# EAGLE design sensor (EAGLE 7.7.0)
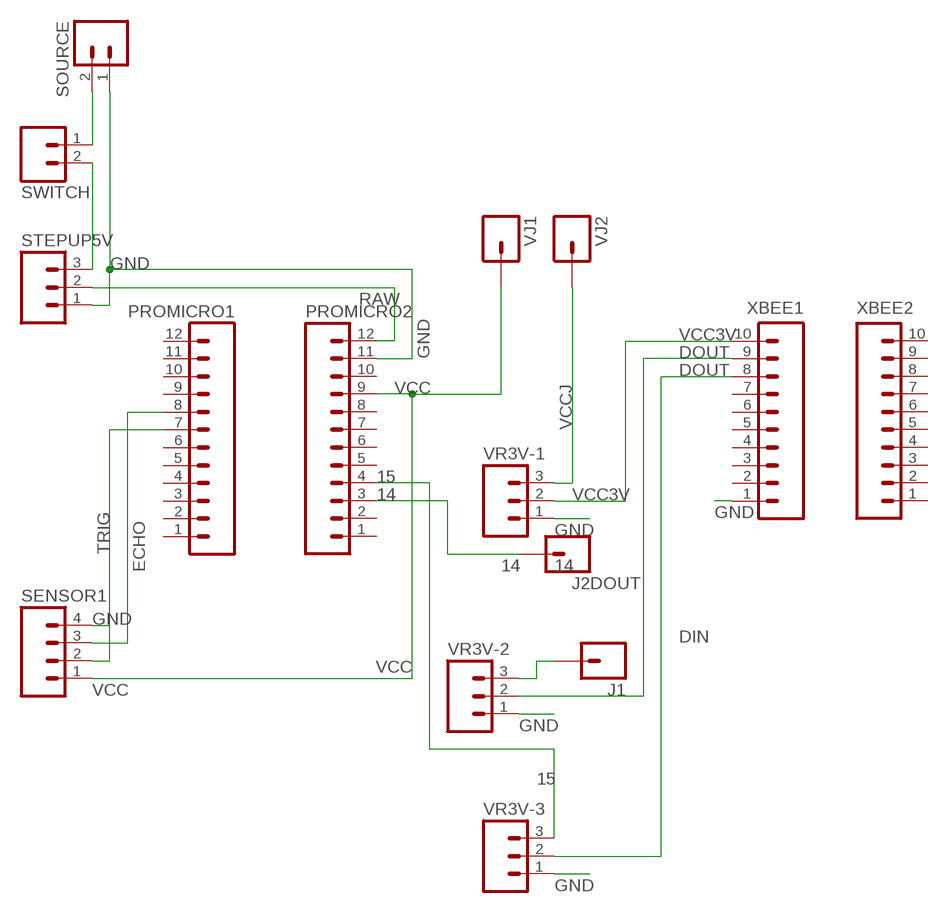
[diagram p0: schematic, sheet 1]

## Parts
J1  M01PTH  [1X01]
J2  M01PTH  [1X01]
PROMICRO1  M12LOCK  [1X12_LOCK]
PROMICRO2  M12LOCK  [1X12_LOCK]
SENSOR1  M04LOCK  [1X04_LOCK]
SOURCE  M02JST-PTH-VERT  [JST-2-PTH-VERT]
STEPUP5V  M03PTH  [1X03]
SWITCH  M02PTH  [1X02]
VJ1  M01PTH  [1X01]
VJ2  M01PTH  [1X01]
VR3V-1  M03PTH  [1X03]
VR3V-2  M03PTH  [1X03]
VR3V-3  M03PTH  [1X03]
XBEE1  M10LOCK  [1X10_LOCK]
XBEE2  M10LOCK  [1X10_LOCK]

## Nets
14: J2.1 PROMICRO2.3
15: PROMICRO2.4 VR3V-3.3
DIN: VR3V-3.2 XBEE1.8
DOUT: VR3V-2.2 XBEE1.9
ECHO: PROMICRO1.8 SENSOR1.3
GND: PROMICRO2.11 SENSOR1.4 SOURCE.1 STEPUP5V.1 VR3V-1.1 VR3V-2.1 VR3V-3.1 XBEE1.1
N$1: SOURCE.2 SWITCH.1
N$2: STEPUP5V.3 SWITCH.2
N$3: J1.1 VR3V-2.3
RAW: PROMICRO2.12 STEPUP5V.2
TRIG: PROMICRO1.7 SENSOR1.2
VCC: PROMICRO2.9 SENSOR1.1 VJ1.1
VCC3V: VR3V-1.2 XBEE1.10
VCCJ: VJ2.1 VR3V-1.3
Unconnected: PROMICRO1.1 PROMICRO1.2 PROMICRO1.3 PROMICRO1.4 PROMICRO1.5 PROMICRO1.6 PROMICRO1.9 PROMICRO1.10 PROMICRO1.11 PROMICRO1.12 PROMICRO2.1 PROMICRO2.2 PROMICRO2.5 PROMICRO2.6 PROMICRO2.7 PROMICRO2.8 PROMICRO2.10 XBEE1.2 XBEE1.3 XBEE1.4 XBEE1.5 XBEE1.6 XBEE1.7 XBEE2.1 XBEE2.2 XBEE2.3 XBEE2.4 XBEE2.5 XBEE2.6 XBEE2.7 XBEE2.8 XBEE2.9 XBEE2.10

## Library data of the parts
J1 J2 VJ1 VJ2 = SparkFun-Connectors:M01: Header 1 Standard 1-pin 0.1" header. Use with straight break away headers (SKU : PRT-00116), right angle break away headers (PRT-00553), swiss pins (PRT-00743), machine pins (PRT-00117), and female headers (PRT-00115). SMTSO-256-ET is a "flush mount" nut for a 4-40 screw. The older package used to be too tight, and did not allow it to sit properly thru the drill hit. The latest (0.165DIA) fits nice and snug.
PROMICRO1 PROMICRO2 = SparkFun-Connectors:M12: Header 12 Standard 12-pin 0.1" header. Use with straight break away headers (SKU : PRT-00116), right angle break away headers (PRT-00553), swiss pins (PRT-00743), machine pins (PRT-00117), and female headers (PRT-00115).
SENSOR1 = SparkFun-Connectors:M04: Header 4 Standard 4-pin 0.1" header. Use with straight break away headers (SKU : PRT-00116), right angle break away headers (PRT-00553), swiss pins (PRT-00743), machine pins (PRT-00117), and female headers (PRT-00115). Molex polarized connector foot print use with SKU : PRT-08231 with associated crimp pins and housings. 1MM SMD Version SKU: PRT-10208; PROD_ID: CONN-09696
SOURCE SWITCH = SparkFun-Connectors:M02: Standard 2-pin 0.1" header. Use with - straight break away headers ( PRT-00116) - right angle break away headers (PRT-00553) - swiss pins (PRT-00743) - machine pins (PRT-00117) - female headers (PRT-00115) Molex polarized connector foot print use with: PRT-08233 with associated crimp pins and housings. 2.54_SCREWTERM for use with PRT-10571. 3.5mm Screw Terminal footprints for PRT-08084 5mm Screw Terminal footprints for use with PRT-08432
STEPUP5V VR3V-1-VR3V-3 = SparkFun-Connectors:M03: Header 3 Standard 3-pin 0.1" header. Use with straight break away headers (SKU : PRT-00116), right angle break away headers (PRT-00553), swiss pins (PRT-00743), machine pins (PRT-00117), and female headers (PRT-00115). Molex polarized connector foot print use with SKU : PRT-08232 with associated crimp pins and housings.
XBEE1 XBEE2 = SparkFun-Connectors:M10: Header 10 Standard 10-pin 0.1" header. Use with straight break away headers (SKU : PRT-00116), right angle break away headers (PRT-00553), swiss pins (PRT-00743), machine pins (PRT-00117), and female headers (PRT-00115).

## Board
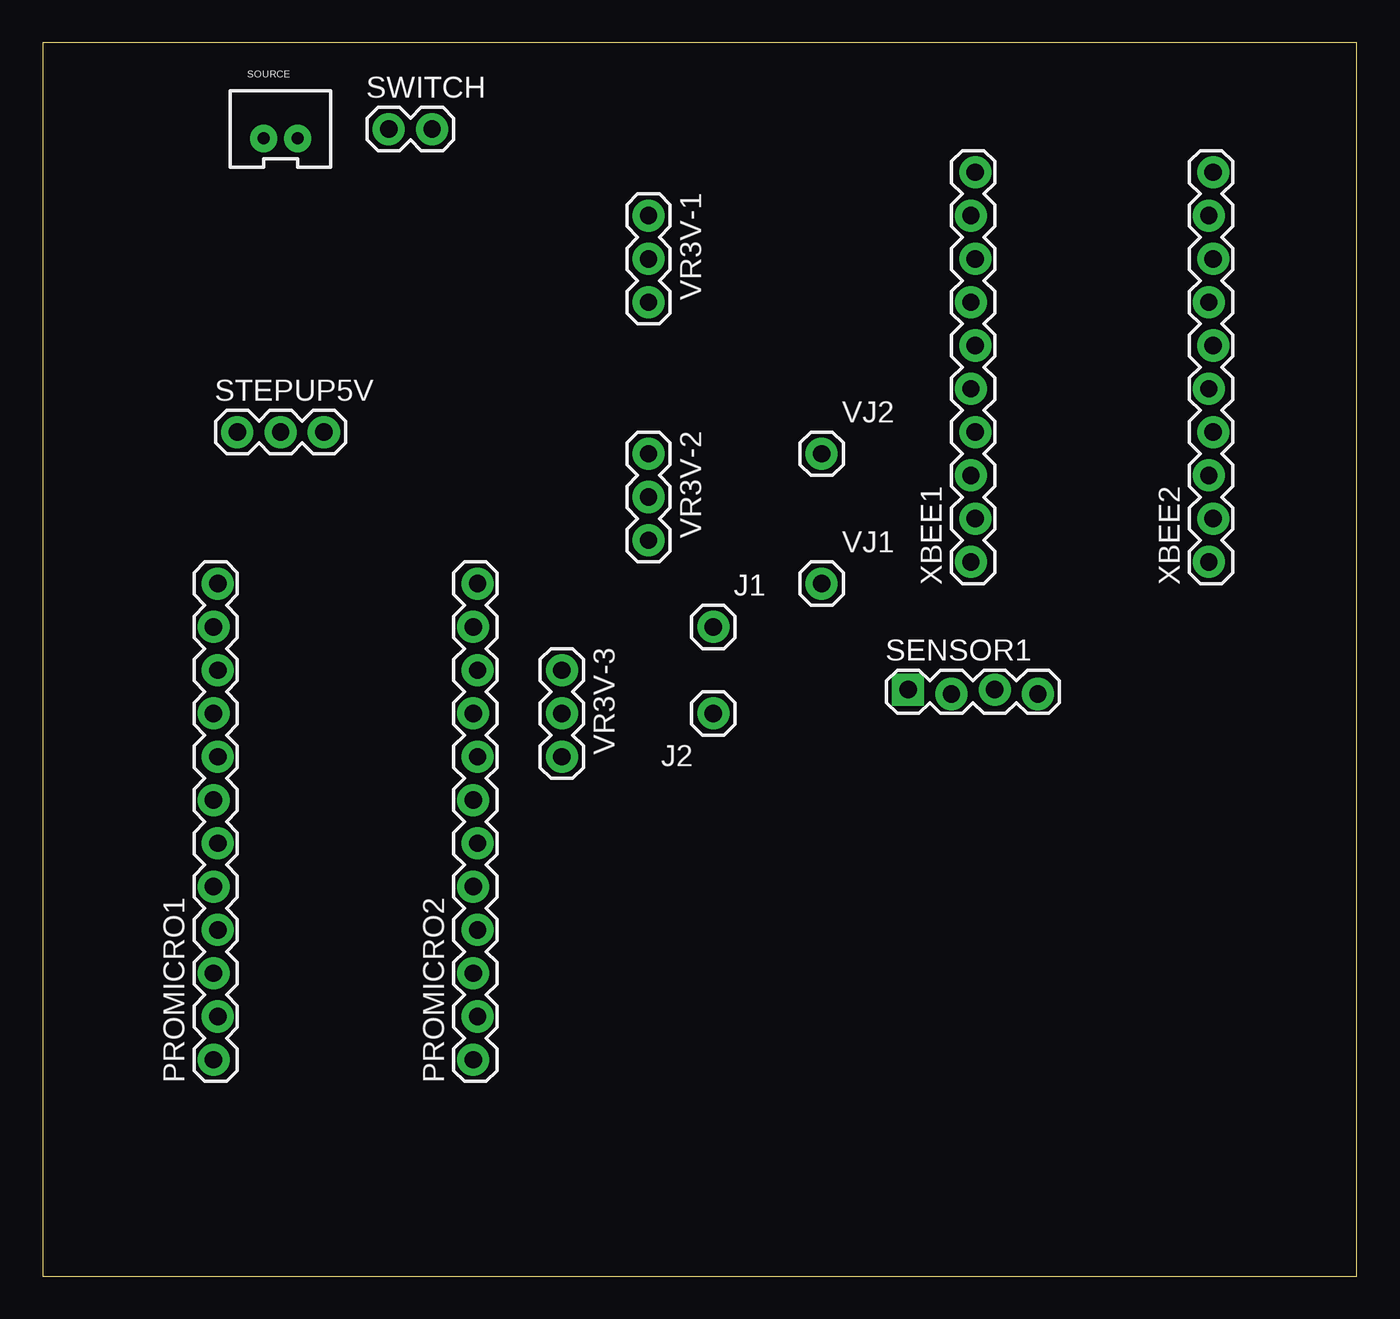
[diagram p1: board, top side]
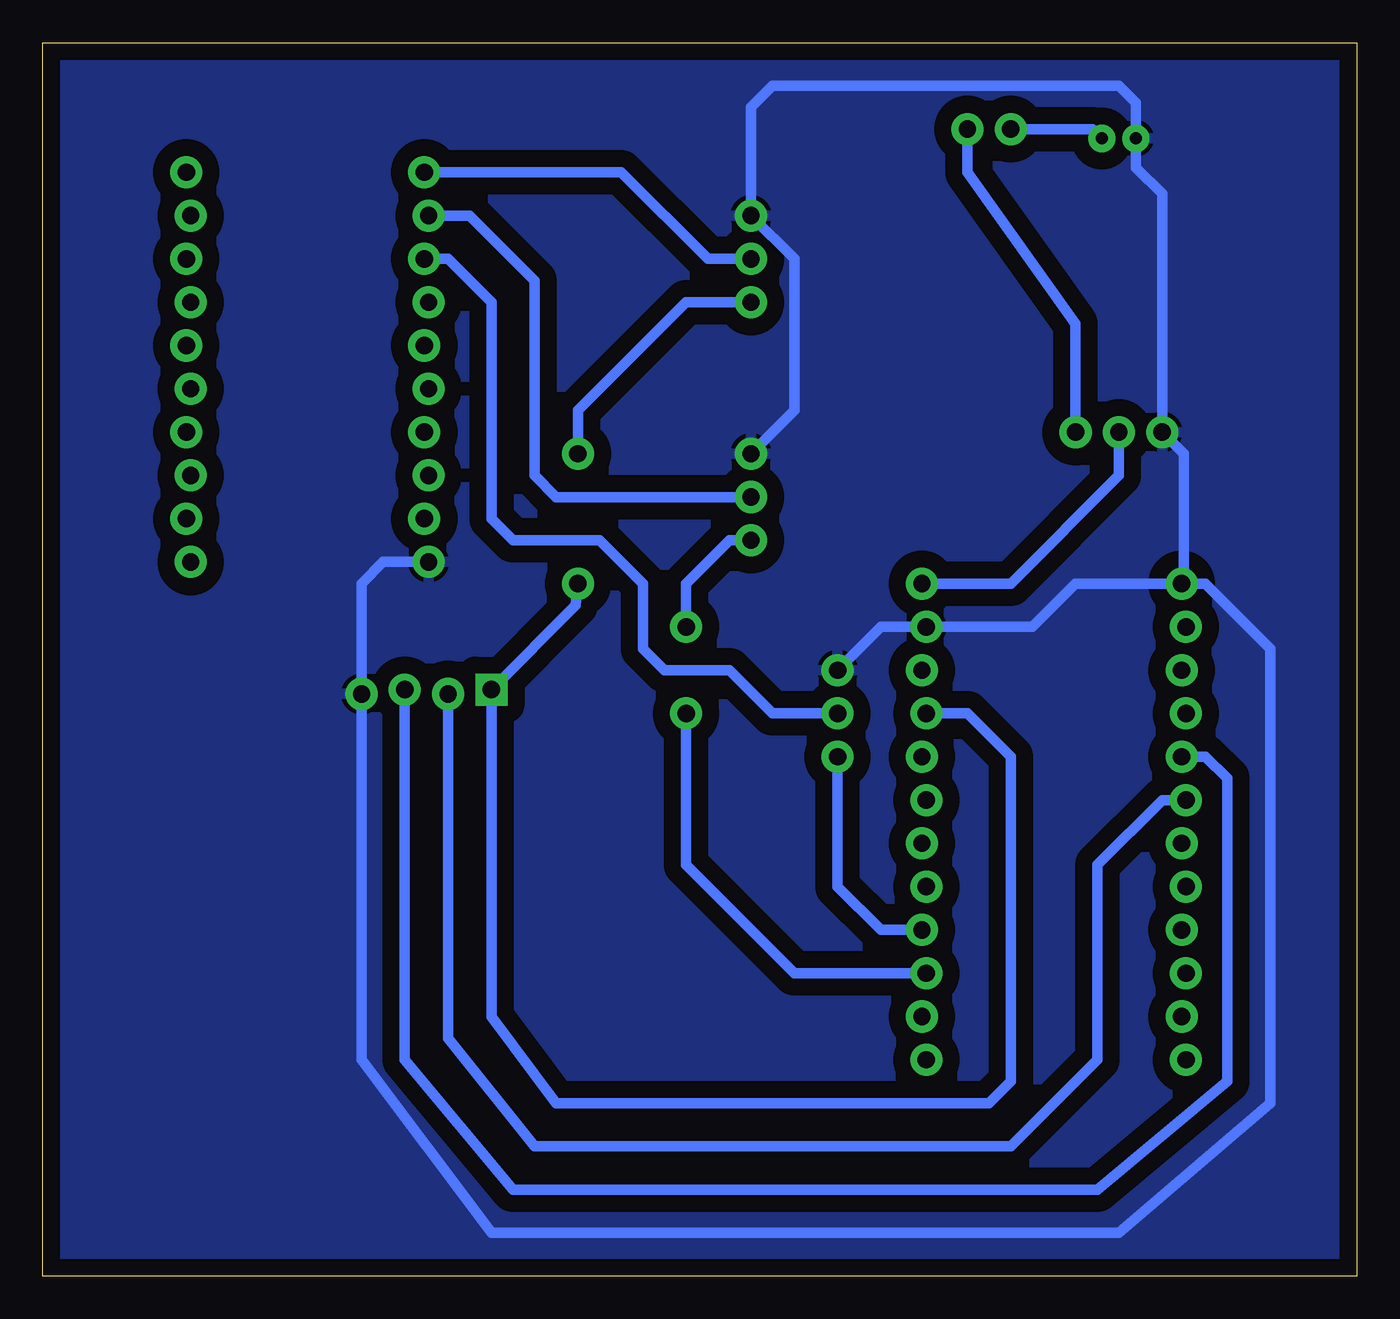
[diagram p2: board, bottom side, seen from below]

Size 77.14 x 72.38 mm. Coordinates in mm from the lower left corner, seen from the top.
Outline: 0,0 77.14,0 77.14,72.38 0,72.38 0,0
Copper layers (1*16): Top 0.035mm / dielectric 1.5mm / Bottom 0.035mm
Design rules "default": minimum track width 10mil, minimum drill 24mil, track to track 8mil, track to pad 8mil, pad to pad 8mil, via to via 8mil, smd to smd 8mil, copper to edge 40mil, drill to drill 8mil, minimum pad ring 10mil, minimum via ring 8mil, stop-mask expansion 4mil, vias tented up to drill 0mil, thermal gap 10mil

### Footprints (pad centres in the part's own frame; a part is rotated, then mirrored left to right if it is on the bottom)
1X01 = drill 1.016 pad 1.88: 1 0,0
1X12_LOCK = drill 1.016 pad 1.88: 1 0,0.127; 2 2.54,-0.127; 3 5.08,0.127; 4 7.62,-0.127; 5 10.16,0.127; 6 12.7,-0.127; 7 15.24,0.127; 8 17.78,-0.127; 9 20.32,0.127; 10 22.86,-0.127; 11 25.4,0.127; 12 27.94,-0.127
1X04_LOCK = drill 1.016 pad 1.88 square: 1 0,0.127 | drill 1.016 pad 1.88: 2 2.54,-0.127; 3 5.08,0.127; 4 7.62,-0.127
JST-2-PTH-VERT = drill 0.7 pad 1.6: 1 -1,-0.55; 2 1,-0.55
1X03 = drill 1.016 pad 1.88: 1 0,0; 2 2.54,0; 3 5.08,0
1X02 = drill 1.016 pad 1.88: 1 0,0; 2 2.54,0
1X10_LOCK = drill 1.016 pad 1.88: 1 0,0.127; 2 2.54,-0.127; 3 5.08,0.127; 4 7.62,-0.127; 5 10.16,0.127; 6 12.7,-0.127; 7 15.24,0.127; 8 17.78,-0.127; 9 20.32,0.127; 10 22.86,-0.127

### Placement (x,y rotation side)
J1  39.37,38.1 0 top
J2  39.37,33.02 180 top
PROMICRO1  10.16,12.7 90 top
PROMICRO2  25.4,12.7 90 top
SENSOR1  50.8,34.29 0 top
SOURCE  13.97,67.31 0 top
STEPUP5V  11.43,49.53 0 top
SWITCH  20.32,67.31 0 top
VJ1  45.72,40.64 0 top
VJ2  45.72,48.26 0 top
VR3V-1  35.56,62.23 270 top
VR3V-2  35.56,48.26 270 top
VR3V-3  30.48,35.56 270 top
XBEE1  54.61,41.91 90 top
XBEE2  68.58,41.91 90 top

### Tracks (layer width: path | path; a pad name or v marks a point on that pad's centre or on a via)
14
  Bottom 0.61: J2.1 39.37,24.13 33.02,17.78 PROMICRO2.3
15
  Bottom 0.61: VR3V-3.3 30.48,22.86 27.94,20.32 PROMICRO2.4
DIN
  Bottom 0.61: XBEE1.8 53.34,59.69 50.8,57.15 50.8,44.45 49.53,43.18 44.45,43.18 41.91,40.64 41.91,36.83 40.64,35.56 36.83,35.56 34.29,33.02 VR3V-3.2
DOUT
  Bottom 0.61: XBEE1.9 52.07,62.23 48.26,58.42 48.26,46.99 46.99,45.72 VR3V-2.2
ECHO
  Bottom 0.61: PROMICRO1.8 8.89,30.48 7.62,29.21 7.62,11.43 15.24,5.08 49.53,5.08 55.88,12.7 SENSOR1.3
GND
  Bottom 0.61: 54.61,41.91 XBEE1.1 57.15,41.91 58.42,40.64 SENSOR1.4 58.42,12.7 50.8,2.54 13.97,2.54 5.08,10.16 5.08,36.83 8.89,40.64 10.16,40.64 | VR3V-2.1 33.02,50.8 33.02,59.69 VR3V-1.1 35.56,68.58 34.29,69.85 13.97,69.85 12.97,68.85 SOURCE.1 12.97,65.04 11.43,63.5 STEPUP5V.1 10.16,48.26 10.16,40.64 | VR3V-3.1 27.94,38.1 PROMICRO2.11 19.05,38.1 16.51,40.64 10.16,40.64
  pour Bottom (isolate 1): 0,72.39 77.47,72.39 77.47,0 0,0
N$1
  Bottom 0.61: SWITCH.1 15.52,67.31 SOURCE.2
N$2
  Bottom 0.61: STEPUP5V.3 16.51,55.88 22.86,64.77 SWITCH.2
N$3
  Bottom 0.61: VR3V-2.3 36.83,43.18 39.37,40.64 J1.1
RAW
  Bottom 0.61: 25.4,40.77 PROMICRO2.12 20.32,40.64 13.97,46.99 STEPUP5V.2
TRIG
  Bottom 0.61: SENSOR1.2 53.34,13.97 48.26,7.62 20.32,7.62 15.24,12.7 15.24,24.13 11.43,27.94 PROMICRO1.7
VCC
  Bottom 0.61: PROMICRO2.9 22.86,33.02 20.32,30.48 20.32,11.43 21.59,10.16 46.99,10.16 50.8,15.24 SENSOR1.1 45.85,39.37 VJ1.1
VCC3V
  Bottom 0.61: VR3V-1.2 38.1,59.69 43.18,64.77 XBEE1.10
VCCJ
  Bottom 0.61: VJ2.1 45.72,50.8 39.37,57.15 VR3V-1.3